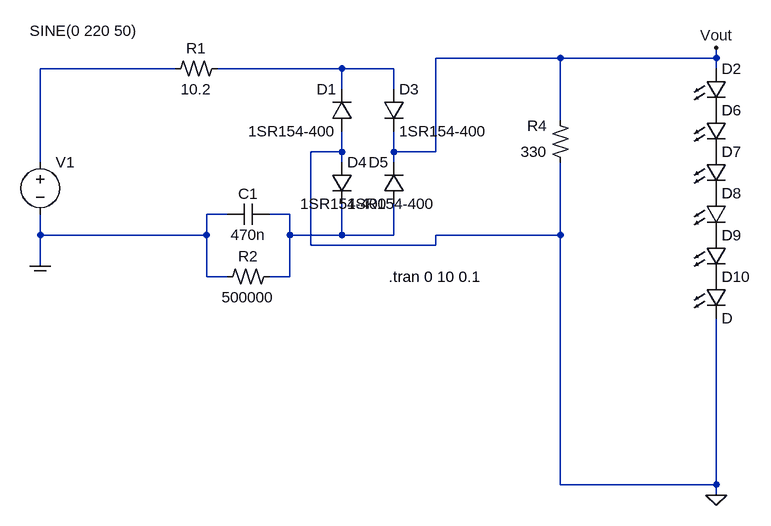
[diagram p0: schematic Capacitive Transformerless.asc]
Capacitive Transformerless.asc, the LTspice schematic file:
Version 4
SHEET 1 1372 832
WIRE 928 144 736 144
WIRE 1168 144 1168 128
WIRE 1168 144 928 144
WIRE 336 160 128 160
WIRE 592 160 400 160
WIRE 672 160 592 160
WIRE 1168 160 1168 144
WIRE 592 192 592 160
WIRE 672 192 672 160
WIRE 928 240 928 144
WIRE 592 288 592 256
WIRE 592 288 544 288
WIRE 672 288 672 256
WIRE 736 288 736 144
WIRE 736 288 672 288
WIRE 128 304 128 160
WIRE 592 304 592 288
WIRE 672 304 672 288
WIRE 416 384 384 384
WIRE 512 384 480 384
WIRE 128 416 128 384
WIRE 384 416 384 384
WIRE 384 416 128 416
WIRE 512 416 512 384
WIRE 592 416 592 368
WIRE 592 416 512 416
WIRE 672 416 672 368
WIRE 672 416 592 416
WIRE 928 416 928 304
WIRE 928 416 736 416
WIRE 544 432 544 288
WIRE 736 432 736 416
WIRE 736 432 544 432
WIRE 128 464 128 416
WIRE 384 480 384 416
WIRE 416 480 384 480
WIRE 512 480 512 416
WIRE 512 480 480 480
WIRE 1168 800 1168 544
WIRE 928 800 928 416
WIRE 1168 800 928 800
WIRE 1168 816 1168 800
FLAG 1168 816 0
FLAG 128 464 COM
FLAG 1168 128 Vout
SYMBOL voltage 128 288 R0
WINDOW 3 -16 -186 Left 2
SYMATTR Value SINE(0 220 50)
SYMATTR InstName V1
SYMBOL res2 480 464 R90
WINDOW 0 0 32 VBottom 2
WINDOW 3 32 32 VTop 2
SYMATTR InstName R2
SYMATTR Value 500000
SYMBOL cap 480 368 R90
WINDOW 0 0 32 VBottom 2
WINDOW 3 32 32 VTop 2
SYMATTR InstName C1
SYMATTR Value 470n
SYMATTR SpiceLine Rser=56m Lser=6.215n mfg="   ---" pn="   ---" type="   ---"
SYMBOL diode 656 192 R0
SYMATTR InstName D3
SYMATTR Value 1SR154-400
SYMBOL res2 400 144 R90
WINDOW 0 0 32 VBottom 2
WINDOW 3 32 32 VTop 2
SYMATTR InstName R1
SYMATTR Value 10.2
SYMBOL res2 944 304 R180
WINDOW 0 36 56 Left 2
WINDOW 3 36 16 Left 2
SYMATTR InstName R4
SYMATTR Value 330
SYMBOL diode 608 256 R180
WINDOW 0 24 64 Left 2
WINDOW 3 24 0 Left 2
SYMATTR InstName D1
SYMATTR Value 1SR154-400
SYMBOL diode 576 304 R0
SYMATTR InstName D4
SYMATTR Value 1SR154-400
SYMBOL diode 688 368 R180
WINDOW 0 24 64 Left 2
WINDOW 3 24 0 Left 2
SYMATTR InstName D5
SYMATTR Value 1SR154-400
SYMBOL LED 1152 160 R0
SYMATTR InstName D2
SYMBOL LED 1152 224 R0
SYMATTR InstName D6
SYMBOL LED 1152 288 R0
SYMATTR InstName D7
SYMBOL LED 1152 352 R0
SYMATTR InstName D8
SYMBOL LED 1152 416 R0
SYMATTR InstName D9
SYMBOL LED 1152 480 R0
SYMATTR InstName D10
TEXT 664 480 Left 2 !.tran 0 10 0.1

The netlist it stands for:
* Capacitive Transformerless.asc
V1 N001 COM SINE(0 220 50)
R2 N003 COM 500000
C1 N003 COM 470n Rser=56m Lser=6.215n mfg="   ---" pn="   ---" type="   ---"
D3 N002 Vout 1SR154-400
R1 N002 N001 10.2
R4 0 Vout 330
D1 0 N002 1SR154-400
D4 0 N003 1SR154-400
D5 N003 Vout 1SR154-400
D2 Vout P001 D
D6 P001 P002 D
D7 P002 P003 D
D8 P003 P004 D
D9 P004 P005 D
D10 P005 0 D
.model D D
.lib standard.dio
.tran 0 10 0.1
.backanno
.end